# EAGLE design BoardTest (EAGLE 4.13)
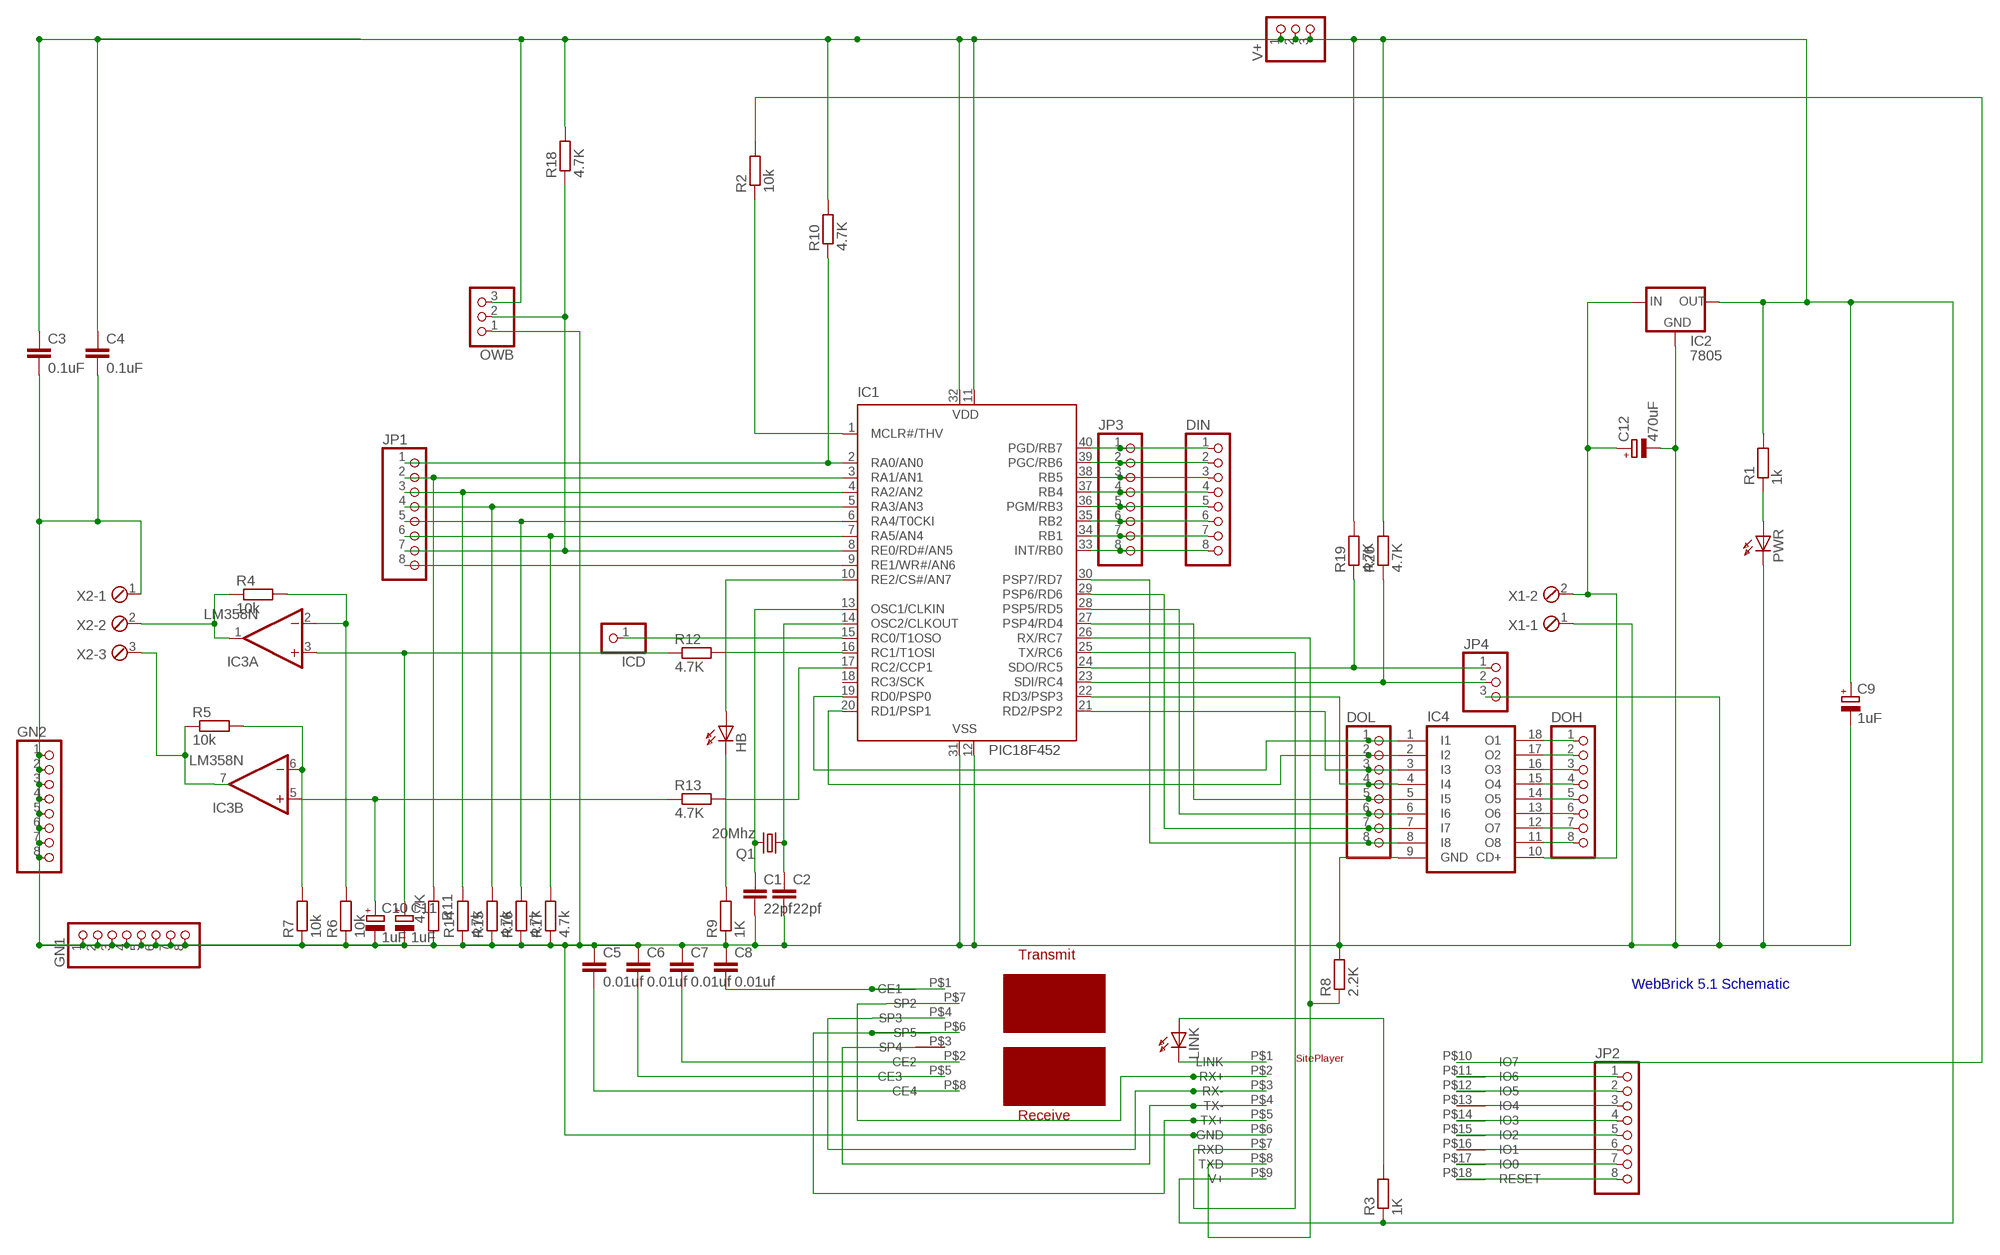
[diagram p0: schematic, sheet 1]

## Parts
C1  22pf  C-EU025-040X050  [C025-040X050]
C2  22pf  C-EU025-040X050  [C025-040X050]
C3  0.1uF  C-EU025-040X050  [C025-040X050]
C4  0.1uF  C-EU025-040X050  [C025-040X050]
C5  0.01uf  C-EU025-040X050  [C025-040X050]
C6  0.01uf  C-EU025-040X050  [C025-040X050]
C7  0.01uf  C-EU025-040X050  [C025-040X050]
C8  0.01uf  C-EU025-040X050  [C025-040X050]
C9  1uF  CPOL-EUE2.5-4V  [E2,5RE]
C10  1uF  CPOL-EUE2.5-4V  [E2,5RE]
C11  1uF  CPOL-EUE2.5-4V  [E2,5RE]
C12  470uF  CPOL-EUE3.5-10  [E3,5-10]
DIN  PINHD-1X8  [1X08]
DOH  PINHD-1X8  [1X08]
DOL  PINHD-1X8  [1X08]
GN1  PINHD-1X8  [1X08]
GN2  PINHD-1X8  [1X08]
HB  LED3MM  [LED3MM]
IC1  PIC18F452  PIC16F877P  [DIL40]
IC2  7805  78XXL  [78XXL]
IC3  LM358N  [DIL08]
IC4  ULN2803A  [DIL18]
ICD  PINHD-1X1  [1X01]
JP1  PINHD-1X8  [1X08]
JP2  PINHD-1X8  [1X08]
JP3  PINHD-1X8  [1X08]
JP4  PINHD-1X3  [1X03]
LINK  LED3MM  [LED3MM]
OWB  PINHD-1X3  [1X03]
PWR  LED3MM  [LED3MM]
Q1  20Mhz  CRYTALHC49S  [HC49/S]
R1  1k  R-EU_0204/7  [0204/7]
R2  10k  R-EU_0204/7  [0204/7]
R3  1K  R-EU_0204/7  [0204/7]
R4  10k  R-EU_0204/7  [0204/7]
R5  10k  R-EU_0204/7  [0204/7]
R6  10k  R-EU_0204/7  [0204/7]
R7  10k  R-EU_0204/7  [0204/7]
R8  2.2K  R-EU_0204/7  [0204/7]
R9  1K  R-EU_0204/7  [0204/7]
R10  4.7K  R-EU_0204/7  [0204/7]
R11  4.7K  R-EU_0204/7  [0204/7]
R12  4.7K  R-EU_0204/7  [0204/7]
R13  4.7K  R-EU_0204/7  [0204/7]
R14  4.7k  R-EU_0204/7  [0204/7]
R15  4.7k  R-EU_0204/7  [0204/7]
R16  4.7k  R-EU_0204/7  [0204/7]
R17  4.7k  R-EU_0204/7  [0204/7]
R18  4.7K  R-EU_0207/7  [0207/7]
R19  4.7K  R-EU_0204/7  [0204/7]
R20  4.7K  R-EU_0204/7  [0204/7]
U$1  PULSETRANSFORMER  [PULSETRANSFORMER]
U$2  SP  [SITEPLAYER]
V+  PINHD-1X3  [1X03]
X1  MPT2  [2POL254]
X2  MPT3  [3POL254]

## Nets
N$1: C1.1 IC1.13(OSC1/CLKIN) Q1.2
N$2: C2.1 IC1.14(OSC2/CLKOUT) Q1.1
N$3: U$1.P$7(SP2) U$2.P$2(RX+)
N$4: U$1.P$4(SP3) U$2.P$3(RX-)
N$5: U$1.P$3(SP4) U$2.P$4(TX-)
N$6: U$1.P$6(SP5) U$2.P$5(TX+)
N$7: C8.2 U$1.P$1(CE1)
N$8: PWR.A R1.1
N$9: C7.2 U$1.P$2(CE2)
N$10: C6.2 U$1.P$5(CE3)
N$11: C5.2 U$1.P$8(CE4)
N$12: IC1.1(MCLR#/THV) R2.1
N$13: IC1.25(TX/RC6) U$2.P$7(RXD)
N$14: IC1.26(RX/RC7) R8.1 U$2.P$8(TXD)
N$15: DOL.1 IC1.19(RD0/PSP0) IC4.1(I1)
N$16: LINK.A R3.2
N$17: LINK.K(C) U$2.P$1(LINK)
N$18: IC1.16(RC1/T1OSI) R12.2
N$19: IC1.17(RC2/CCP1) R13.2
N$20: IC3.2(A:-IN) R4.2 R6.2
N$21: IC3.1(A:OUT) R4.1 X2.2
N$22: DOL.2 IC1.20(RD1/PSP1) IC4.2(I2)
N$23: DOL.3 IC1.21(RD2/PSP2) IC4.3(I3)
N$24: IC3.6(B:-IN) R5.2 R7.2
N$25: IC3.7(B:OUT) R5.1 X2.3
N$26: DOL.4 IC1.22(RD3/PSP3) IC4.4(I4)
N$27: DOL.5 IC1.27(PSP4/RD4) IC4.5(I5)
N$28: DOL.6 IC1.28(PSP5/RD5) IC4.6(I6)
N$29: DOL.7 IC1.29(PSP6/RD6) IC4.7(I7)
N$30: DOL.8 IC1.30(PSP7/RD7) IC4.8(I8)
N$31: DOH.1 IC4.18(O1)
N$32: DOH.2 IC4.17(O2)
N$33: DOH.3 IC4.16(O3)
N$34: DOH.4 IC4.15(O4)
N$35: DOH.5 IC4.14(O5)
N$36: DOH.6 IC4.13(O6)
N$37: DOH.7 IC4.12(O7)
N$38: DOH.8 IC4.11(O8)
N$39: DIN.1 IC1.40(PGD/RB7) JP3.1
N$40: DIN.2 IC1.39(PGC/RB6) JP3.2
N$41: DIN.3 IC1.38(RB5) JP3.3
N$42: DIN.4 IC1.37(RB4) JP3.4
N$43: DIN.5 IC1.36(PGM/RB3) JP3.5
N$44: DIN.6 IC1.35(RB2) JP3.6
N$45: DIN.7 IC1.34(RB1) JP3.7
N$46: DIN.8 IC1.33(INT/RB0) JP3.8
N$47: IC1.2(RA0/AN0) JP1.1 R10.1
N$48: IC1.3(RA1/AN1) JP1.2 R11.1
N$49: IC1.4(RA2/AN2) JP1.3 R14.2
N$50: IC1.5(RA3/AN3) JP1.4 R15.2
N$51: IC1.6(RA4/T0CKI) JP1.5 R16.2
N$52: IC1.7(RA5/AN4) JP1.6 R17.2
N$53: IC1.8(RE0/RD#/AN5) JP1.7 OWB.2 R18.1
N$54: IC1.9(RE1/WR#/AN6) JP1.8
N$55: HB.K(C) R9.2
N$56: JP2.1 U$2.P$11(IO6)
N$57: JP2.2 U$2.P$12(IO5)
N$58: JP2.3 U$2.P$13(IO4)
N$59: JP2.4 U$2.P$14(IO3)
N$60: JP2.5 U$2.P$15(IO2)
N$61: JP2.6 U$2.P$16(IO1)
N$62: JP2.7 U$2.P$17(IO0)
N$63: JP2.8 U$2.P$18(RESET)
N$64: HB.A IC1.10(RE2/CS#/AN7)
N$65: C11.+ IC3.3(A:+IN) R12.1
N$66: C10.+ IC3.5(B:+IN) R13.1
N$67: IC1.24(SDO/RC5) JP4.1 R19.1
N$68: IC1.23(SDI/RC4) JP4.2 R20.1
N$69: IC1.15(RC0/T1OSO) ICD.1
N$70: R2.2 U$2.P$10(IO7)
V+: C12.+ IC2.IN IC4.10(CD+) X1.2
V-: C1.2 C2.2 C3.2 C4.2 C5.1 C6.1 C7.1 C8.1 C9.- C10.- C11.- C12.- GN1.1 GN1.2 GN1.3 GN1.4 GN1.5 GN1.6 GN1.7 GN1.8 GN2.1 GN2.2 GN2.3 GN2.4 GN2.5 GN2.6 GN2.7 GN2.8 IC1.12(VSS) IC1.31(VSS) IC2.GND IC4.9(GND) JP4.3 OWB.1 PWR.K(C) R6.1 R7.1 R8.2 R9.1 R11.2 R14.1 R15.1 R16.1 R17.1 U$2.P$6(GND) X1.1 X2.1
VDD: C3.1 C4.1 C9.+ IC1.11(VDD) IC1.32(VDD) IC2.OUT OWB.3 R1.2 R3.1 R10.2 R18.2 R19.2 R20.2 U$2.P$9(V+) V+.1 V+.2 V+.3
Unconnected: IC1.18(RC3/SCK)

## Notes on the sheet
- WebBrick 5.1 Schematic

## Power pins joined to a net without a drawn wire
V+: IC3.8(P:V+)
V-: IC3.4(P:V-)

## Library data of the parts
C1-C8 = rcl:C-EU: CAPACITOR, European symbol
C9-C12 = rcl:CPOL-EU: POLARIZED CAPACITOR, European symbol
DIN DOH DOL GN1 GN2 JP1-JP3 = pinhead:PINHD-1X8: PIN HEADER
HB LINK PWR = led:LED: LED
IC1 = microchip:PIC16F87*: MICROCONTROLLER
IC2 = v-reg:78XXL: VOLTAGE REGULATOR
IC3 = linear:LM358: OP AMP
IC4 = uln-udn:ULN2803A: DRIVER ARRAY
ICD = pinhead:PINHD-1X1: PIN HEADER
JP4 OWB V+ = pinhead:PINHD-1X3: PIN HEADER
Q1 = crystal:CRYTAL: CRYSTAL
R1-R20 = rcl:R-EU_: RESISTOR, European symbol
U$1 = PulseTrans:PULSETRANSFORMER: 10 BASE-T FILTER
U$2 = siteplayer:SP: SitePlayer
X1 = con-phoenix-254:MPT2: PHOENIX CONNECTOR
X2 = con-phoenix-254:MPT3: PHOENIX CONNECTOR

## Board
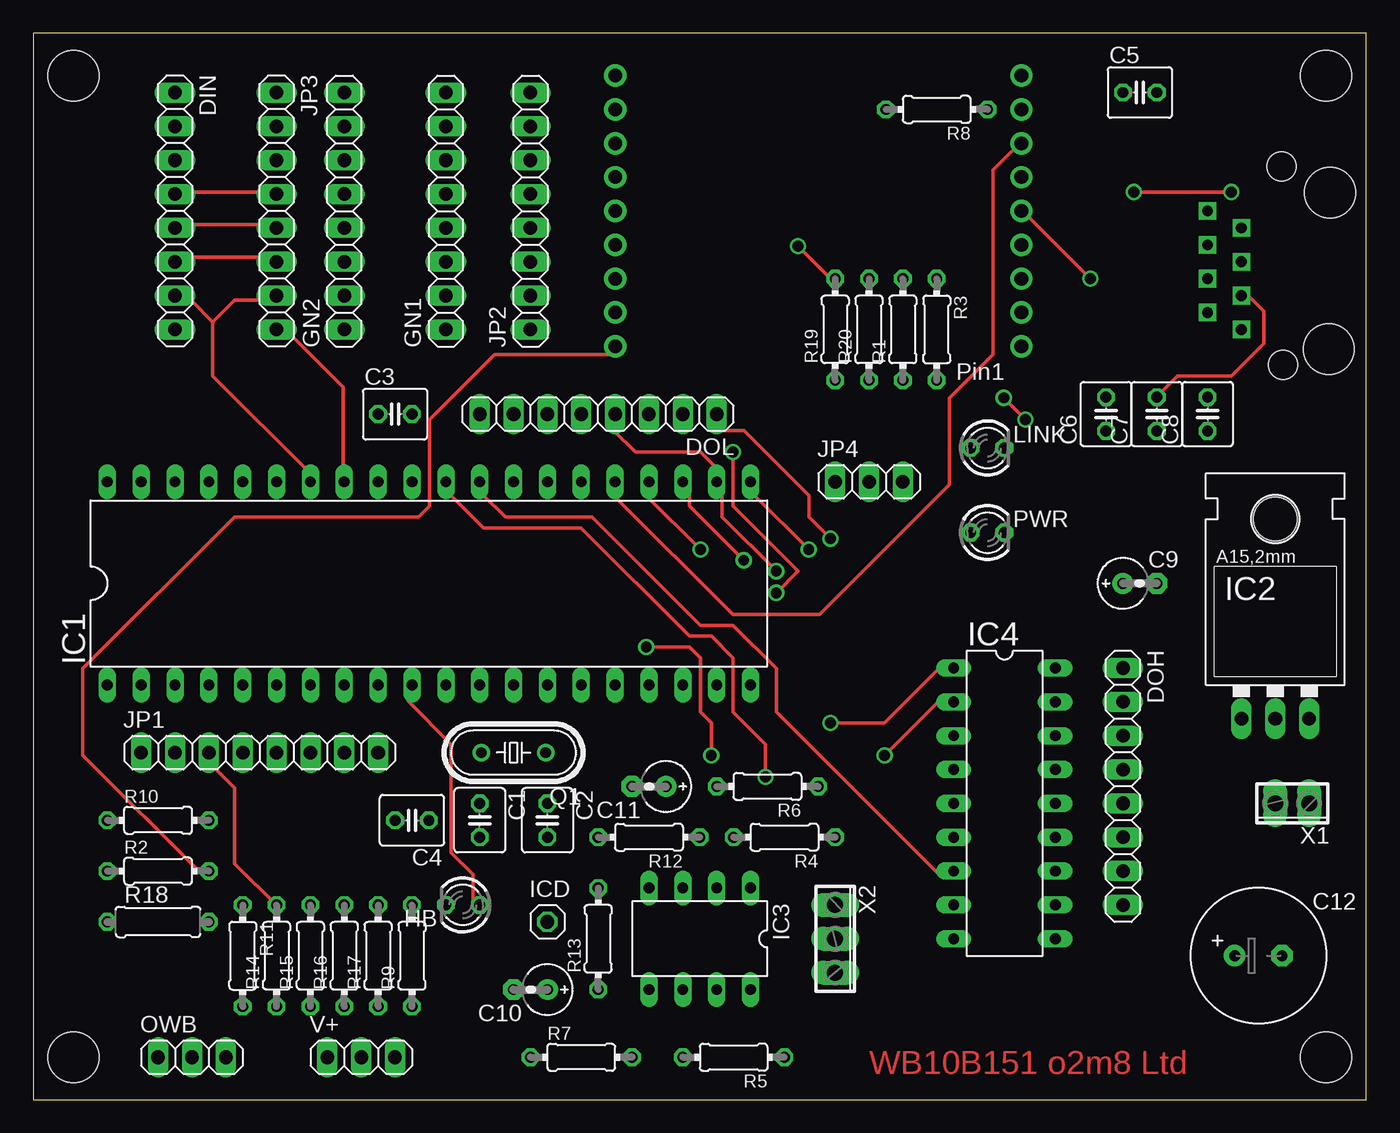
[diagram p1: board, top side]
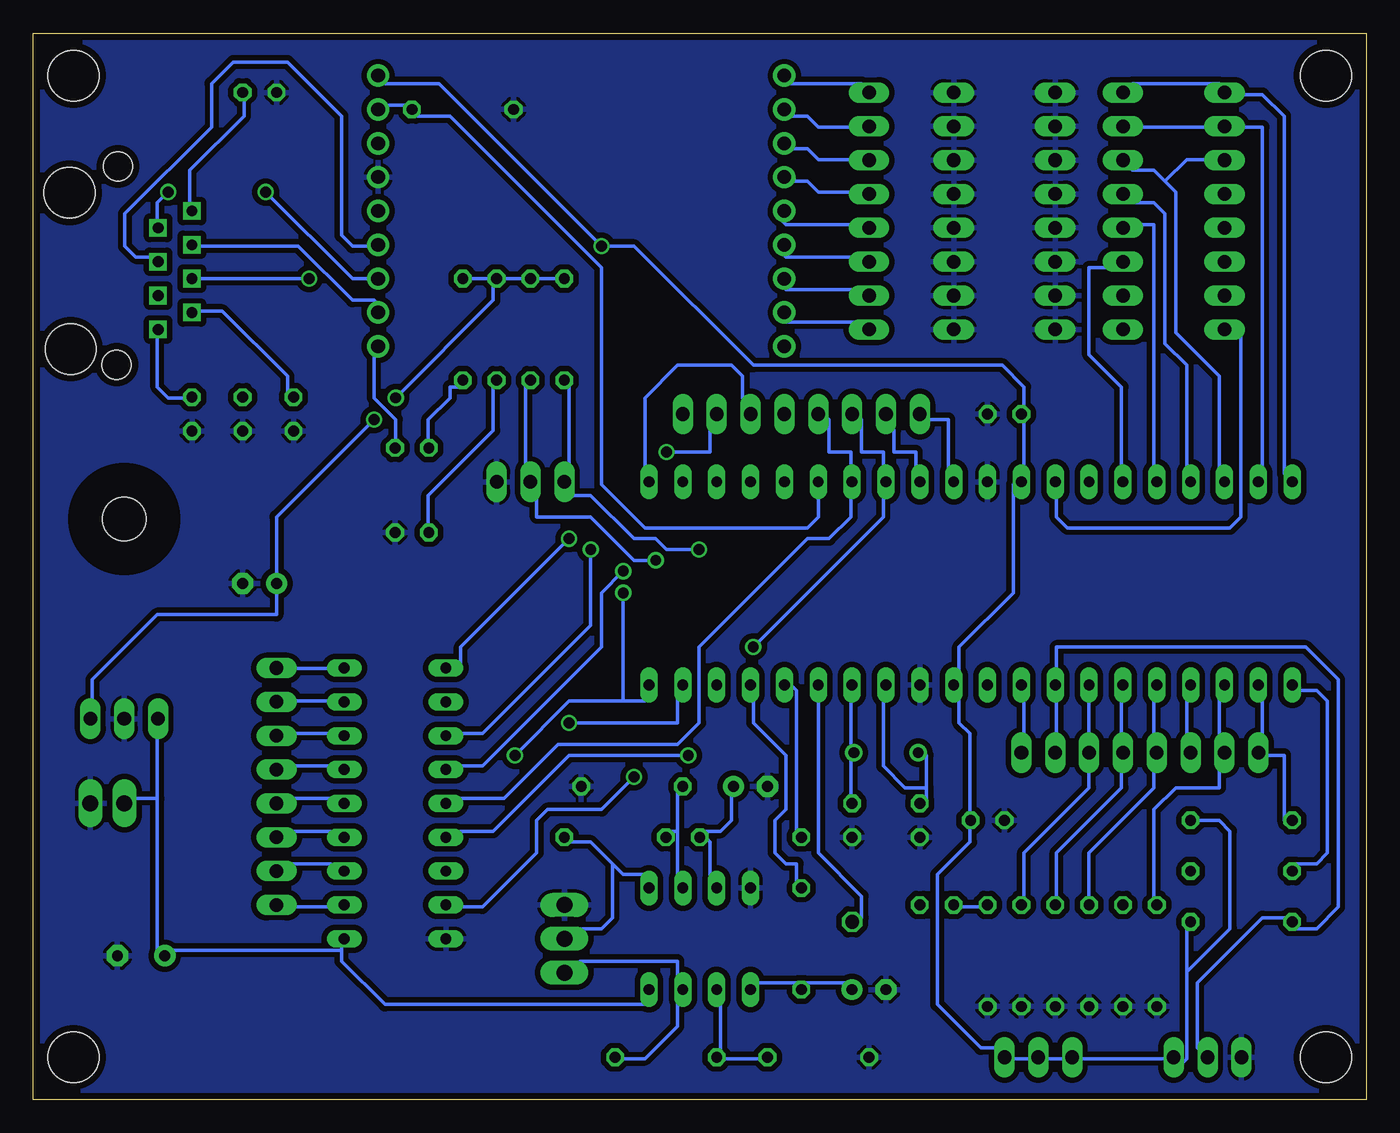
[diagram p2: board, bottom side, seen from below]

Size 100 x 80 mm. Coordinates in mm from the lower left corner, seen from the top.
Outline: 0,0 100,0 100,80 0,80 0,0
Copper layers (1*16): Top 0.035mm / dielectric 1.5mm / Bottom 0.035mm
Design rules "default": minimum track width 10mil, minimum drill 32mil, track to track 16mil, track to pad 16mil, pad to pad 12mil, via to via 12mil, smd to smd 8mil, copper to edge 20mil, drill to drill 10mil, minimum pad ring 10mil, minimum via ring 8mil, stop-mask expansion 4mil, vias tented up to drill 0mil, thermal gap 10mil
Holes 3.81 mm at 3.01,76.83 96.99,76.83 96.99,3.17 3.01,3.17

### Footprints (pad centres in the part's own frame; a part is rotated, then mirrored left to right if it is on the bottom)
C025-040X050 = drill 0.813 octagon: 1 -1.27,0; 2 1.27,0
E2,5RE = drill 0.813 pad 1.575 round: + -1.27,0 | drill 0.813 pad 1.575 octagon: - 1.27,0
E3,5-10 = drill 0.813 pad 1.6 round: + -1.778,0 | drill 0.813 pad 1.6 octagon: - 1.778,0
1X08 = drill 1.016 long: 1 -8.89,0; 2 -6.35,0; 3 -3.81,0; 4 -1.27,0; 5 1.27,0; 6 3.81,0; 7 6.35,0; 8 8.89,0
LED3MM = drill 0.813 octagon: A -1.27,0; K 1.27,0
DIL40 = drill 0.813 long: 1 -24.13,-7.62; 2 -21.59,-7.62; 3 -19.05,-7.62; 4 -16.51,-7.62; 5 -13.97,-7.62; 6 -11.43,-7.62; 7 -8.89,-7.62; 8 -6.35,-7.62; 9 -3.81,-7.62; 10 -1.27,-7.62; 11 1.27,-7.62; 12 3.81,-7.62; 13 6.35,-7.62; 14 8.89,-7.62; 15 11.43,-7.62; 16 13.97,-7.62; 17 16.51,-7.62; 18 19.05,-7.62; 19 21.59,-7.62; 20 24.13,-7.62; 21 24.13,7.62; 22 21.59,7.62; 23 19.05,7.62; 24 16.51,7.62; 25 13.97,7.62; 26 11.43,7.62; 27 8.89,7.62; 28 6.35,7.62; 29 3.81,7.62; 30 1.27,7.62; 31 -1.27,7.62; 32 -3.81,7.62; 33 -6.35,7.62; 34 -8.89,7.62; 35 -11.43,7.62; 36 -13.97,7.62; 37 -16.51,7.62; 38 -19.05,7.62; 39 -21.59,7.62; 40 -24.13,7.62
78XXL = drill 1.016 long: GND 0,-3.81; IN -2.54,-3.81; OUT 2.54,-3.81 | hole 3.302: 0,11.176
DIL08 = drill 0.813 long: 1 -3.81,-3.81; 2 -1.27,-3.81; 3 1.27,-3.81; 4 3.81,-3.81; 5 3.81,3.81; 6 1.27,3.81; 7 -1.27,3.81; 8 -3.81,3.81
DIL18 = drill 0.813 long: 1 -10.16,-3.81; 2 -7.62,-3.81; 3 -5.08,-3.81; 4 -2.54,-3.81; 5 0,-3.81; 6 2.54,-3.81; 7 5.08,-3.81; 8 7.62,-3.81; 9 10.16,-3.81; 10 10.16,3.81; 11 7.62,3.81; 12 5.08,3.81; 13 2.54,3.81; 14 0,3.81; 15 -2.54,3.81; 16 -5.08,3.81; 17 -7.62,3.81; 18 -10.16,3.81
1X01 = drill 1.016 octagon: 1 0,0
1X03 = drill 1.016 long: 1 -2.54,0; 2 0,0; 3 2.54,0
HC49/S = drill 0.813 round: 1 -2.413,0; 2 2.413,0
0204/7 = drill 0.813 octagon: 1 -3.81,0; 2 3.81,0
0207/7 = drill 0.813 octagon: 1 -3.81,0; 2 3.81,0
PULSETRANSFORMER = drill 0.813 square: P$1 -5.08,2.54; P$2 -2.54,2.54; P$3 0,2.54; P$4 2.54,2.54; P$5 -3.81,5.08; P$6 -1.27,5.08; P$7 1.27,5.08; P$8 3.81,5.08 | hole 3.81: 5.172,-4.11; -6.55,-4.01 | hole 2.184: -7.72,-0.57; 7.158,-0.47
SITEPLAYER = drill 1.016 pad 1.676 round: P$1 -15.24,10.16; P$2 -15.24,7.62; P$3 -15.24,5.08; P$4 -15.24,2.54; P$5 -15.24,0; P$6 -15.24,-2.54; P$7 -15.24,-5.08; P$8 -15.24,-7.62; P$9 -15.24,-10.16; P$10 15.24,10.16; P$11 15.24,7.62; P$12 15.24,5.08; P$13 15.24,2.54; P$14 15.24,0; P$15 15.24,-2.54; P$16 15.24,-5.08; P$17 15.24,-7.62; P$18 15.24,-10.16
2POL254 = drill 1.2 long: 1 -1.27,0; 2 1.27,0
3POL254 = drill 1.2 long: 1 -2.54,0; 2 0,0; 3 2.54,0

### Placement (x,y rotation side)
C1  33.49,20.95 270 top
C2  38.57,20.95 270 top
C3  27.14,51.43 0 top
C4  28.41,20.95 180 top
C5  83.02,75.56 0 top
C6  80.48,51.43 90 top
C7  84.29,51.43 90 top
C8  88.1,51.43 90 top
C9  83.02,38.73 0 top
C10  37.3,8.25 180 top
C11  46.19,23.49 180 top
C12  91.91,10.79 0 top
DIN  10.63,66.67 270 top
DOH  81.75,23.49 270 top
DOL  42.38,51.43 180 top
GN1  30.95,66.67 90 top
GN2  23.33,66.67 90 top
HB  32.22,14.6 180 top
IC1  29.68,38.73 0 top
IC2  93.18,32.38 0 top
IC3  50,12.06 180 top
IC4  72.86,22.22 270 top
ICD  38.57,13.33 0 top
JP1  16.98,26.03 0 top
JP2  37.3,66.67 90 top
JP3  18.25,66.67 270 top
JP4  62.7,46.35 0 top
LINK  71.59,48.89 0 top
OWB  11.9,3.17 0 top
PWR  71.59,42.54 0 top
Q1  36.03,26.03 180 top
R1  65.24,57.78 90 top
R2  9.36,17.14 0 top
R3  67.78,57.78 270 top
R4  56.35,19.68 180 top
R5  52.54,3.17 180 top
R6  55.08,23.49 180 top
R7  41.11,3.17 0 top
R8  67.78,74.29 180 top
R9  28.41,10.79 90 top
R10  9.36,20.95 0 top
R11  15.71,10.79 270 top
R12  46.19,19.68 180 top
R13  42.38,12.06 90 top
R14  18.25,10.79 90 top
R15  20.79,10.79 90 top
R16  23.33,10.79 90 top
R17  25.87,10.79 90 top
R18  9.36,13.33 0 top
R19  60.16,57.78 90 top
R20  62.7,57.78 90 top
U$1  93.18,62.86 90 top
U$2  58.89,66.67 180 top
V+  24.6,3.17 0 top
X1  94.45,22.22 180 top
X2  60.16,12.06 270 top

### Tracks (layer width: path | path; a pad name or v marks a point on that pad's centre or on a via)
N$1
  Bottom 0.254: 32.98,23.39 32.98,25.83 Q1.2 | 32.98,23.39 32.98,22.58 C1.1 | 32.98,23.39 34.61,23.39 36.23,25.01 36.23,29.89 IC1.13
N$2
  Bottom 0.254: C2.1 38.67,22.58 38.67,25.83 Q1.1 38.67,26.64 38.67,29.89 IC1.14
N$3
  Bottom 0.254: U$1.P$7 88.25,64.03 80.12,64.03 76.06,59.96 74.44,59.96 73.62,59.15 U$2.P$2
N$4  (via drill 0.81)
  Top 0.254: v82.56,68.09 v89.88,68.09
  Bottom 0.254: v89.88,68.09 90.69,67.28 90.69,65.65 U$1.P$4 | v82.56,68.09 76.06,61.59 U$2.P$3
N$5
  Bottom 0.254: U$1.P$3 90.69,63.22 92.32,63.22 93.13,64.03 93.13,66.47 86.63,72.97 86.63,76.22 85,77.85 80.94,77.85 76.87,73.78 76.87,64.84 76.06,64.03 74.44,64.03 U$2.P$4
N$6  (via drill 0.81)
  Top 0.254: v79.31,61.59 74.44,66.47 U$2.P$5
  Bottom 0.254: v79.31,61.59 U$1.P$6 88.25,61.59
N$7
  Bottom 0.254: C8.2 88.25,52.65 89.88,52.65 90.69,53.46 90.69,57.53 U$1.P$1
N$8
  Bottom 0.254: PWR.A 70.37,42.9 70.37,45.33 65.49,50.21 65.49,53.46 R1.1
N$9
  Top 0.254: C7.2 84.19,52.65 85.81,54.28 89.88,54.28 92.32,56.71 92.32,59.15 90.69,60.78 U$1.P$2
N$10
  Bottom 0.254: C6.2 80.94,52.65 80.94,54.28 85.81,59.15 88.25,59.15 U$1.P$5
N$11
  Bottom 0.254: U$1.P$8 88.25,67.28 88.25,69.72 84.19,73.78 84.19,75.41 C5.2
N$12
  Bottom 0.254: R2.1 5.35,17.7 3.72,17.7 2.91,18.51 2.91,29.89 3.72,30.7 5.35,30.7 IC1.1
N$13
  Top 0.254: IC1.25 43.55,45.33 52.49,36.39 58.99,36.39 68.75,46.15 68.75,52.65 72,55.9 72,69.72 73.62,71.34 U$2.P$7
N$14
  Bottom 0.254: IC1.26 41.11,43.71 41.92,42.9 54.12,42.9 57.37,46.15 57.37,62.4 68.75,73.78 71.18,73.78 R8.1 72,74.59 73.62,74.59 U$2.P$8
N$15  (via drill 0.81)
  Top 0.254: v59.8,28.27 63.87,28.27 67.93,32.33 IC4.1 | v59.8,42.08 58.18,43.71 58.18,45.33 53.3,50.21 51.68,50.21 DOL.1
  Bottom 0.254: v59.8,28.27 51.68,28.27 51.68,30.7 IC1.19 | v59.8,42.08 67.93,33.96 67.93,32.33 IC4.1
N$16
  Bottom 0.254: LINK.A 70.37,49.4 70.37,51.02 68.75,52.65 68.75,53.46 67.93,53.46 R3.2
N$17
  Bottom 0.254: LINK.K 72.81,49.4 72.81,51.02 74.44,52.65 74.44,55.9 U$2.P$1
N$18
  Bottom 0.254: R12.2 42.74,20.14 42.74,30.7 43.55,31.52 IC1.16
N$19
  Bottom 0.254: R13.2 42.74,16.07 42.74,17.7 43.55,17.7 44.36,18.51 44.36,20.95 43.55,21.76 43.55,25.83 45.99,28.27 45.99,29.89 IC1.17
N$20
  Bottom 0.254: 51.68,20.14 51.68,23.39 R6.2 | 51.68,20.14 51.68,16.89 IC3.2 | 51.68,20.14 52.49,20.14 R4.2
N$21
  Bottom 0.254: 56.55,17.7 58.18,19.32 59.8,19.32 R4.1 | 56.55,17.7 55.74,16.89 54.12,16.89 IC3.1 | 56.55,17.7 56.55,13.64 57.37,12.82 58.99,12.82 X2.2
N$22  (via drill 0.81)
  Top 0.254: v63.87,25.83 67.93,29.89 IC4.2 | v52.49,48.59 52.49,44.52 57.37,39.64 v55.74,38.02
  Bottom 0.254: 55.74,29.89 59.8,29.89 v63.87,25.83 | 55.74,29.89 54.12,29.89 IC1.20 | v52.49,48.59 49.24,48.59 49.24,50.21 DOL.2 | 55.74,29.89 v55.74,38.02
N$23  (via drill 0.81)
  Top 0.254: v58.18,41.27 54.12,45.33 IC1.21
  Bottom 0.254: v58.18,41.27 58.18,35.58 66.31,27.45 67.93,27.45 IC4.3 | DOL.3 46.8,52.65 46.8,54.28 47.61,55.09 51.68,55.09 54.12,52.65 54.12,46.96 IC1.21
N$24
  Bottom 0.254: 48.42,3.07 45.17,3.07 R7.2 | 48.42,3.07 48.42,7.13 IC3.6 | 48.42,3.07 R5.2
N$25
  Bottom 0.254: R5.1 55.74,3.07 54.12,3.07 51.68,5.51 51.68,7.13 IC3.7 51.68,8.76 51.68,10.38 58.99,10.38 X2.3
N$26  (via drill 0.81)
  Top 0.254: v55.74,39.64 51.68,43.71 51.68,45.33 IC1.22 51.68,46.96 50.05,48.59 45.17,48.59 43.55,50.21 DOL.4
  Bottom 0.254: v55.74,39.64 57.37,38.02 57.37,33.96 66.31,25.01 67.93,25.01 IC4.4
N$27
  Bottom 0.254: DOL.5 41.11,51.84 40.3,51.02 40.3,48.59 38.67,48.59 38.67,46.96 IC1.27 38.67,45.33 38.67,43.71 40.3,42.08 41.92,42.08 50.05,33.96 50.05,28.27 51.68,26.64 60.62,26.64 64.68,22.58 67.93,22.58 IC4.5
N$28  (via drill 0.81)
  Top 0.254: v50.86,25.83 50.86,28.27 50.05,29.08 50.05,33.14 49.24,33.96 v45.99,33.96
  Bottom 0.254: DOL.6 37.86,51.02 37.86,48.59 36.23,48.59 36.23,46.96 IC1.28 36.23,45.33 36.23,43.71 v45.99,33.96 | v50.86,25.83 59.8,25.83 65.49,20.14 67.93,20.14 IC4.6
N$29
  Top 0.254: IC4.7 67.93,16.89 55.74,29.08 55.74,32.33 52.49,35.58 50.05,35.58 41.92,43.71 35.42,43.71 33.8,45.33 IC1.29
  Bottom 0.254: IC1.29 33.8,46.96 33.8,48.59 35.42,48.59 35.42,50.21 DOL.7
N$30  (via drill 0.81)
  Top 0.254: v54.93,24.2 54.93,26.64 52.49,29.08 52.49,33.14 50.86,34.77 49.24,34.77 41.11,42.9 33.8,42.9 31.36,45.33 IC1.30
  Bottom 0.254: IC1.30 31.36,46.96 31.36,51.02 32.98,51.02 DOL.8 | v54.93,24.2 57.37,21.76 61.43,21.76 62.24,20.95 62.24,18.51 66.31,14.45 67.93,14.45 IC4.8
N$31
  Bottom 0.254: IC4.18 77.69,32.33 80.94,32.33 DOH.1
N$32
  Bottom 0.254: IC4.17 77.69,29.89 80.94,29.89 DOH.2
N$33
  Bottom 0.254: IC4.16 77.69,27.45 80.94,27.45 DOH.3
N$34
  Bottom 0.254: IC4.15 77.69,25.01 80.94,25.01 DOH.4
N$35
  Bottom 0.254: IC4.14 77.69,22.58 80.94,22.58 DOH.5
N$36
  Bottom 0.254: IC4.13 77.69,20.14 80.94,20.14 DOH.6
N$37
  Bottom 0.254: IC4.12 77.69,17.7 80.94,17.7 DOH.7
N$38
  Bottom 0.254: IC4.11 77.69,14.45 80.94,14.45 DOH.8
N$39
  Bottom 0.254: IC1.40 6.16,46.96 6.16,73.78 7.79,75.41 9.41,75.41 DIN.1 11.04,76.22 17.54,76.22 JP3.1
N$40
  Bottom 0.254: IC1.39 7.79,46.96 7.79,72.97 9.41,72.97 DIN.2 11.85,72.97 17.54,72.97 JP3.2
N$41
  Bottom 0.254: 15.1,68.91 15.91,69.72 17.54,69.72 18.35,70.53 JP3.3 | 15.1,68.91 14.29,68.09 14.29,57.53 11.04,54.28 11.04,46.96 IC1.38 | 15.1,68.91 13.48,70.53 11.85,70.53 DIN.3
N$42
  Top 0.254: DIN.4 11.85,68.09 17.54,68.09 JP3.4
  Bottom 0.254: IC1.37 13.48,46.96 13.48,55.09 15.1,56.71 15.1,66.47 15.91,67.28 17.54,67.28 JP3.4
N$43
  Top 0.254: DIN.5 11.85,65.65 17.54,65.65 JP3.5
  Bottom 0.254: IC1.36 15.91,46.96 15.91,65.65 17.54,65.65 JP3.5
N$44
  Top 0.254: DIN.6 11.85,63.22 17.54,63.22 JP3.6
  Bottom 0.254: IC1.35 18.35,46.96 18.35,53.46 20.79,55.9 20.79,62.4 19.16,62.4 JP3.6
N$45
  Top 0.254: 13.48,58.34 13.48,54.28 20.79,46.96 IC1.34 | 13.48,58.34 11.85,59.96 DIN.7 | 13.48,58.34 15.1,59.96 17.54,59.96 JP3.7
N$46
  Top 0.254: JP3.8 19.16,57.53 23.23,53.46 23.23,46.96 IC1.33
  Bottom 0.254: IC1.33 23.23,45.33 23.23,43.71 22.42,42.9 10.22,42.9 9.41,43.71 9.41,57.53 DIN.8
N$47
  Bottom 0.254: R10.1 6.16,20.95 6.16,25.83 7.79,25.83 JP1.1 7.79,27.45 7.79,29.89 IC1.2
N$48
  Bottom 0.254: R11.1 15.91,14.45 15.91,21.76 14.29,23.39 11.04,23.39 11.04,25.01 JP1.2 11.04,27.45 11.04,30.7 IC1.3
N$49
  Top 0.254: R14.2 18.35,14.45 15.1,17.7 15.1,23.39 13.48,25.01 JP1.3
  Bottom 0.254: IC1.4 13.48,29.89 13.48,27.45 JP1.3
N$50
  Bottom 0.254: 20.79,14.45 R15.2 20.79,18.51 15.91,23.39 15.91,25.01 JP1.4 15.91,27.45 15.91,29.89 IC1.5
N$51
  Bottom 0.254: R16.2 23.23,14.45 23.23,18.51 18.35,23.39 18.35,25.01 JP1.5 18.35,27.45 18.35,29.89 IC1.6
N$52
  Bottom 0.254: R17.2 25.67,14.45 25.67,18.51 20.79,23.39 JP1.6 IC1.7
N$53
  Bottom 0.254: JP1.7 23.23,27.45 23.23,29.89 IC1.8 23.23,32.33 23.23,33.96 4.53,33.96 2.1,31.52 2.1,14.45 3.72,12.82 5.35,12.82 R18.1 6.16,13.64 7.79,13.64 12.66,8.76 12.66,3.88 11.85,3.07 OWB.2
N$54
  Bottom 0.254: IC1.9 25.67,29.89 25.67,27.45 JP1.8
N$55
  Bottom 0.254: R9.2 28.92,14.45 30.54,14.45 HB.K
N$56
  Bottom 0.254: JP2.1 37.86,58.34 43.55,58.34 U$2.P$11
N$57
  Bottom 0.254: JP2.2 38.67,60.78 43.55,60.78 U$2.P$12
N$58
  Bottom 0.254: JP2.3 38.67,63.22 43.55,63.22 44.36,64.03 U$2.P$13
N$59
  Bottom 0.254: JP2.4 38.67,65.65 43.55,65.65 44.36,66.47 U$2.P$14
N$60
  Bottom 0.254: JP2.5 38.67,68.09 41.11,68.09 41.92,68.91 43.55,68.91 U$2.P$15
N$61
  Bottom 0.254: JP2.6 38.67,70.53 41.11,70.53 41.92,71.34 43.55,71.34 U$2.P$16
N$62
  Bottom 0.254: JP2.7 38.67,72.97 41.11,72.97 41.92,73.78 43.55,73.78 U$2.P$17
N$63
  Bottom 0.254: JP2.8 37.86,76.22 43.55,76.22 U$2.P$18
N$64
  Top 0.254: HB.A 32.98,14.45 32.98,16.89 31.36,18.51 31.36,26.64 28.11,29.89 IC1.10
N$65
  Bottom 0.254: 50.05,20.14 49.24,19.32 49.24,16.89 IC3.3 | 50.05,20.14 48.42,20.14 47.61,20.95 47.61,23.39 C11.+ | 50.05,20.14 R12.1
N$66
  Bottom 0.254: 42.74,8.76 45.99,8.76 IC3.5 | 42.74,8.76 38.67,8.76 C10.+ | 42.74,8.76 R13.1
N$67  (via drill 0.81)
  Top 0.254: v50.05,41.27 45.99,45.33 IC1.24
  Bottom 0.254: v50.05,41.27 52.49,41.27 53.3,42.08 54.93,42.08 58.18,45.33 59.8,45.33 JP4.1 59.8,47.77 59.8,53.46 R19.1
N$68  (via drill 0.81)
  Top 0.254: v53.3,40.46 49.24,44.52 49.24,45.33 IC1.23
  Bottom 0.254: v53.3,40.46 54.93,40.46 58.18,43.71 62.24,43.71 62.24,45.33 JP4.2 63.06,47.77 63.06,53.46 R20.1
N$69
  Bottom 0.254: IC1.15 41.11,18.51 37.86,15.26 37.86,13.64 ICD.1
N$70
  Top 0.254: R2.2 12.66,16.89 3.72,25.83 3.72,32.33 15.1,43.71 28.92,43.71 29.73,44.52 29.73,51.02 34.61,55.9 43.55,55.9 U$2.P$10
V+
  Bottom 0.254: 90.69,22.58 90.69,27.45 IC2.IN | 90.69,22.58 92.32,22.58 X1.2 | 90.69,22.58 90.69,11.2 C12.+ 89.88,11.2 76.87,11.2 | 76.87,11.2 76.87,12.01 IC4.10 | 76.87,11.2 76.87,10.38 73.62,7.13 54.12,7.13 IC3.8
V-
  pour Bottom: 0.47,79.37 99.53,79.37 99.53,78.1 99.53,0.63 0.47,0.63
VDD  (via drill 0.81)
  Top 0.254: v57.37,64.03 59.8,61.59 R19.2 | v72.81,52.65 v74.44,51.02
  Bottom 0.254: 13.48,9.57 13.48,3.07 14.29,2.26 OWB.3 15.1,3.07 21.6,3.07 V+.1 22.42,3.07 24.04,3.07 V+.2 24.85,3.07 26.48,3.07 V+.3 27.29,3.88 28.92,3.88 32.17,7.13 32.17,16.89 29.73,19.32 29.73,20.95 | 13.48,9.57 13.48,12.82 R18.2 | 13.48,9.57 10.22,12.82 10.22,20.14 11.04,20.95 R10.2 | 29.73,20.95 29.73,27.45 30.54,28.27 30.54,30.7 IC1.11 30.54,31.52 30.54,33.96 26.48,38.02 26.48,46.15 IC1.32 25.67,46.96 25.67,51.02 C3.1 25.67,51.84 25.67,53.46 27.29,55.09 45.99,55.09 54.93,64.03 v57.37,64.03 69.56,76.22 73.62,76.22 U$2.P$9 | 29.73,20.95 C4.1 | IC2.OUT 95.57,29.89 95.57,31.52 90.69,36.39 81.75,36.39 C9.+ 81.75,43.71 v74.44,51.02 | 65.49,61.59 R3.1 67.93,61.59 | R19.2 R20.2 R1.2 65.49,61.59 | v72.81,52.65 65.49,59.96 65.49,61.59

### Text on the board
Top: WB10B151 o2m8 Ltd